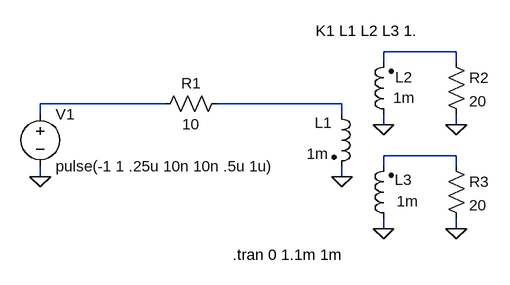
[diagram p0: schematic BasicXformer.asc]
BasicXformer.asc, the LTspice schematic file:
Version 4
SHEET 1 880 680
WIRE 320 -64 208 -64
WIRE 208 -48 208 -64
WIRE 320 -48 320 -64
WIRE -128 16 -320 16
WIRE 144 16 -48 16
WIRE -320 32 -320 16
WIRE 144 32 144 16
WIRE 208 48 208 32
WIRE 320 48 320 32
WIRE 320 96 208 96
WIRE 208 112 208 96
WIRE 320 112 320 96
WIRE -320 128 -320 112
WIRE 144 128 144 112
WIRE 208 208 208 192
WIRE 320 208 320 192
FLAG -320 128 0
FLAG 144 128 0
FLAG 208 48 0
FLAG 208 208 0
FLAG 320 208 0
FLAG 320 48 0
SYMBOL ind2 128 16 R0
WINDOW 0 1 29 Right 0
WINDOW 3 -4 77 Right 0
SYMATTR InstName L1
SYMATTR Value 1m
SYMATTR Type ind
SYMBOL ind2 224 48 R180
WINDOW 0 -2 73 Right 0
WINDOW 3 1 41 Right 0
SYMATTR InstName L2
SYMATTR Value 1m
SYMATTR Type ind
SYMBOL ind2 224 208 R180
WINDOW 0 -1 75 Right 0
WINDOW 3 -4 42 Right 0
SYMATTR InstName L3
SYMATTR Value 1m
SYMATTR Type ind
SYMBOL voltage -320 16 R0
SYMATTR InstName V1
SYMATTR Value pulse(-1 1 .25u 10n 10n .5u 1u)
SYMBOL res -32 0 R90
WINDOW 0 0 56 VBottom 0
WINDOW 3 32 56 VTop 0
SYMATTR InstName R1
SYMATTR Value 10
SYMBOL res 304 -64 R0
SYMATTR InstName R2
SYMATTR Value 20
SYMBOL res 304 96 R0
SYMATTR InstName R3
SYMATTR Value 20
TEXT 104 -96 Left 0 !K1 L1 L2 L3 1.
TEXT -24 248 Left 0 !.tran 0 1.1m 1m

The netlist it stands for:
* BasicXformer.asc
L1 N003 0 1m
L2 0 N001 1m
L3 0 N004 1m
V1 N002 0 pulse(-1 1 .25u 10n 10n .5u 1u)
R1 N003 N002 10
R2 N001 0 20
R3 N004 0 20
K1 L1 L2 L3 1.
.tran 0 1.1m 1m
.backanno
.end